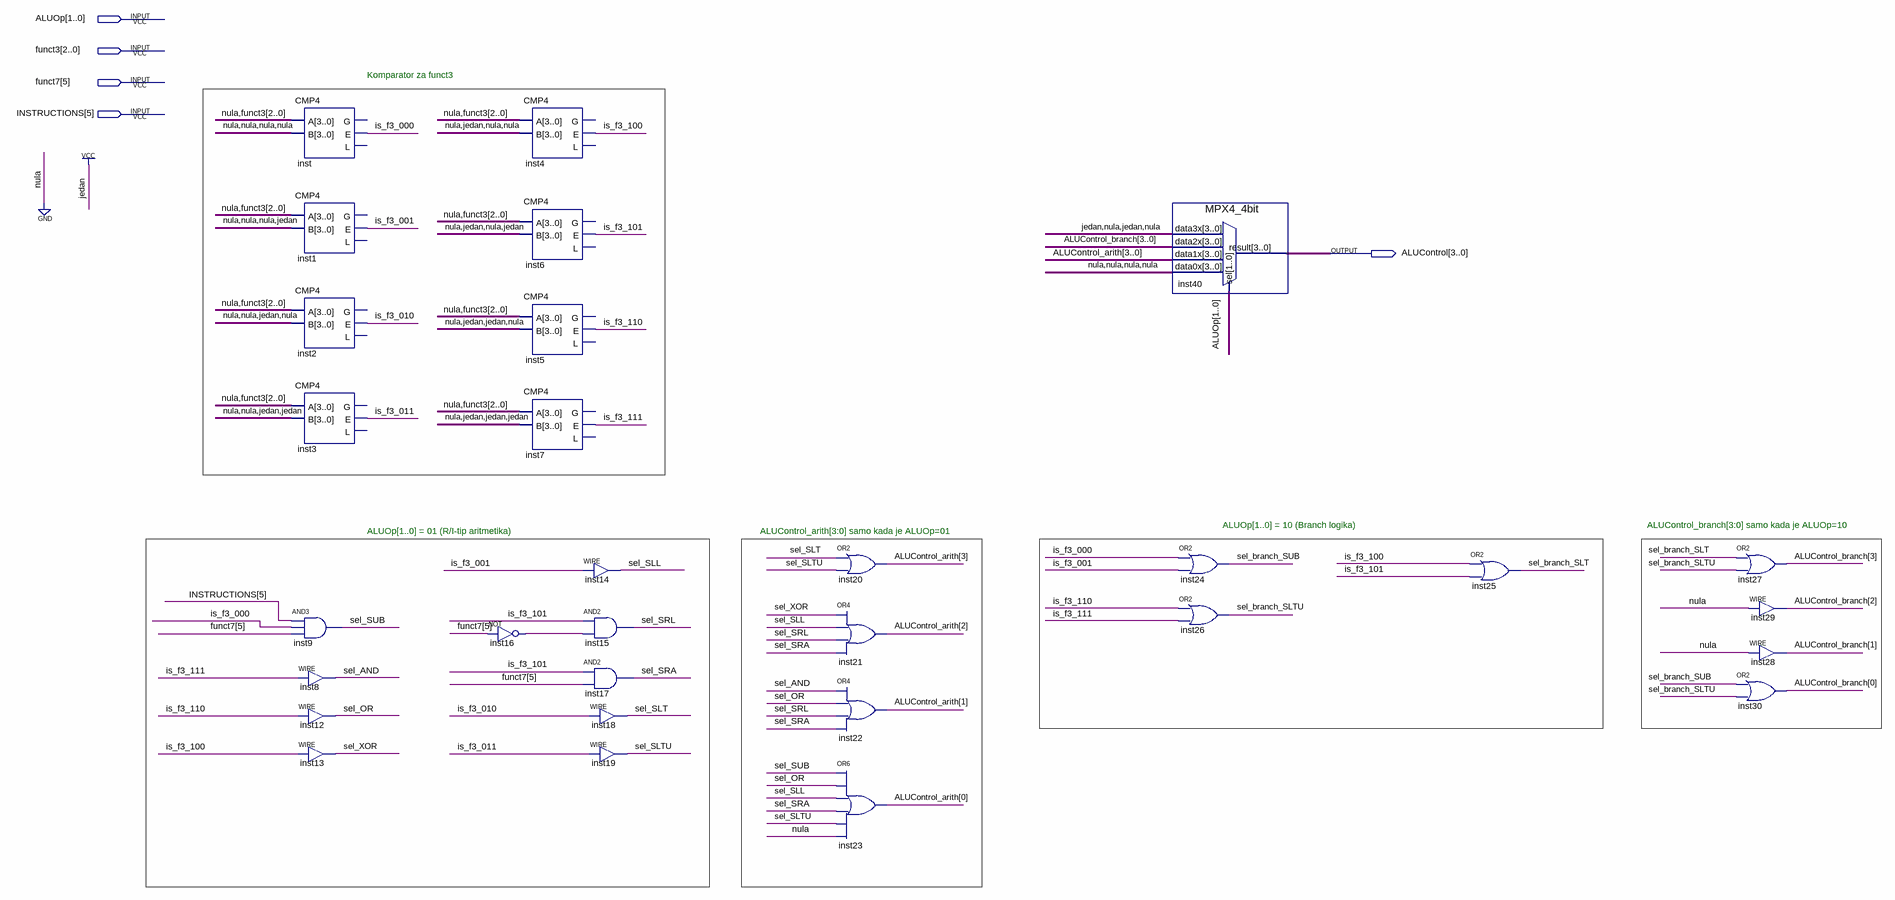
[diagram p0: schematic sheet]
// Quartus schematic ALUDecoder.bdf as structural Verilog: 30 symbols, 5 pins
module ALUDecoder (
  input  [1:0] ALUOp,
  input  [2:0] funct3,
  input  [5:5] funct7,
  input  [5:5] INSTRUCTIONS,
  output [3:0] ALUControl
);

  wire inst16_out, is_f3_000, is_f3_001, is_f3_010, is_f3_011, is_f3_100, is_f3_101, is_f3_110, is_f3_111,
       sel_AND, sel_branch_SLT, sel_branch_SLTU, sel_branch_SUB, sel_OR, sel_SLL, sel_SLT, sel_SLTU, sel_SRA,
       sel_SRL, sel_SUB, sel_XOR;
  wire [3:0] ALUControl_arith, ALUControl_branch;

  CMP4 inst (.A({1'b0, funct3}), .B(4'b0000), .E(is_f3_000));  // open: G, L
  CMP4 inst1 (.A({1'b0, funct3}), .B(4'b0001), .E(is_f3_001));  // open: G, L
  CMP4 inst2 (.A({1'b0, funct3}), .B(4'b0010), .E(is_f3_010));  // open: G, L
  CMP4 inst3 (.A({1'b0, funct3}), .B(4'b0011), .E(is_f3_011));  // open: G, L
  and inst9 (sel_SUB, INSTRUCTIONS[5], is_f3_000, funct7[5]);
  assign sel_AND = is_f3_111;  // WIRE inst8
  assign sel_OR = is_f3_110;  // WIRE inst12
  assign sel_XOR = is_f3_100;  // WIRE inst13
  not inst16 (inst16_out, funct7[5]);
  CMP4 inst4 (.A({1'b0, funct3}), .B(4'b0100), .E(is_f3_100));  // open: G, L
  CMP4 inst6 (.A({1'b0, funct3}), .B(4'b0101), .E(is_f3_101));  // open: G, L
  CMP4 inst5 (.A({1'b0, funct3}), .B(4'b0110), .E(is_f3_110));  // open: G, L
  CMP4 inst7 (.A({1'b0, funct3}), .B(4'b0111), .E(is_f3_111));  // open: G, L
  assign sel_SLL = is_f3_001;  // WIRE inst14
  and inst15 (sel_SRL, is_f3_101, inst16_out);
  and inst17 (sel_SRA, is_f3_101, funct7[5]);
  assign sel_SLT = is_f3_010;  // WIRE inst18
  assign sel_SLTU = is_f3_011;  // WIRE inst19
  or inst20 (ALUControl_arith[3], sel_SLT, sel_SLTU);
  or inst21 (ALUControl_arith[2], sel_XOR, sel_SLL, sel_SRL, sel_SRA);
  or inst22 (ALUControl_arith[1], sel_AND, sel_OR, sel_SRL, sel_SRA);
  or inst23 (ALUControl_arith[0], sel_SUB, sel_OR, sel_SLL, sel_SRA, sel_SLTU, 1'b0);
  MPX4_4bit inst40 (
    .data3x(4'b1010), .data2x(ALUControl_branch), .data1x(ALUControl_arith), .data0x(4'b0000), .sel(ALUOp),
    .result(ALUControl));
  or inst24 (sel_branch_SUB, is_f3_000, is_f3_001);
  or inst26 (sel_branch_SLTU, is_f3_110, is_f3_111);
  or inst25 (sel_branch_SLT, is_f3_100, is_f3_101);
  or inst27 (ALUControl_branch[3], sel_branch_SLT, sel_branch_SLTU);
  assign ALUControl_branch[2] = 1'b0;  // WIRE inst29
  assign ALUControl_branch[1] = 1'b0;  // WIRE inst28
  or inst30 (ALUControl_branch[0], sel_branch_SUB, sel_branch_SLTU);

  // Notes on the sheet:
  //   Komparator za funct3
  //   ALUOp[1..0] = 10 (Branch logika)
  //   ALUControl_branch[3:0] samo kada je ALUOp=10
  //   ALUOp[1..0] = 01 (R/I-tip aritmetika)
  //   ALUControl_arith[3:0] samo kada je ALUOp=01
endmodule
